# EAGLE design Circuit (EAGLE 9.6.2)
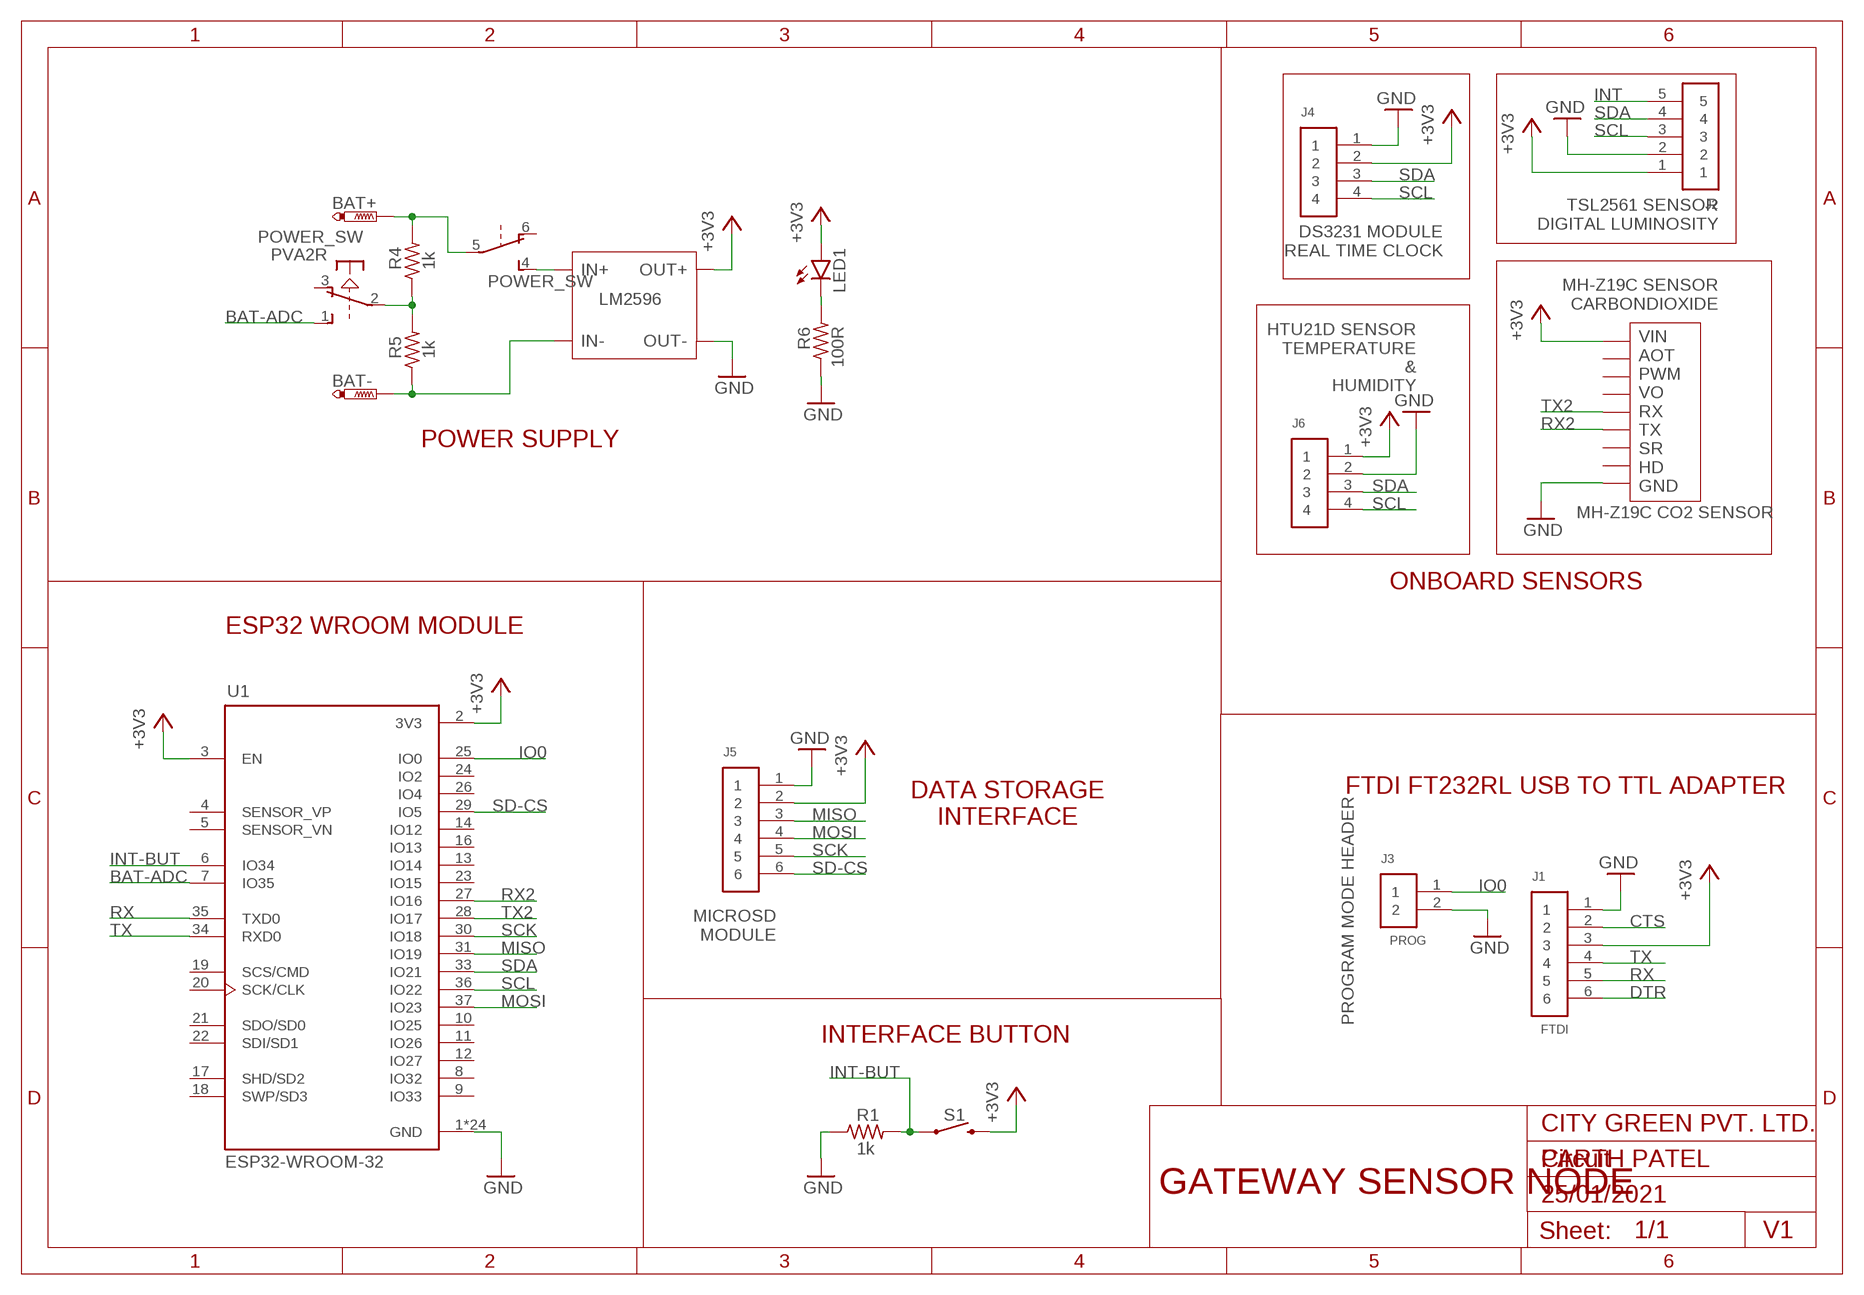
[diagram p0: schematic, sheet 1]

## Parts
BAT+  PTR1TP20SQ  [TP20SQ]
BAT-  PTR1TP20SQ  [TP20SQ]
J1  FTDI  61300611121  [61300611121]
J2  TSL2561  61300511121  [61300511121]
J3  PROG  61300211121  [61300211121]
J4  DS3231  61300411121  [61300411121]
J5  MicroSD  61300611121  [61300611121]
J6  HTU21D  61300411121  [61300411121]
LED1  LED3MM  [LED3MM]
POWER_SW  PVA2R  [PVA2R]
R1  1k  R-US_0204/7  [0204/7]
R4  1k  R-US_0204/7  [0204/7]
R5  1k  R-US_0204/7  [0204/7]
R6  100R  R-US_0204/7  [0204/7]
S1  MOMENTARY-SWITCH-SPST-PTH-6.0MM  [TACTILE_SWITCH_PTH_6.0MM]
U1  ESP32-WROOM-32  [MODULE_ESP32-WROOM-32]
U$1  MH-Z19C  [MH-Z19C]
U$2  XL6009  [XL6009]

## Nets
+3V3: J1.3 J2.1 J4.2 J5.2 J6.1 LED1.A S1.3 U1.2(3V3) U1.3(EN) U$1.PWM(VIN) U$2.OUT+
BAT-ADC: POWER_SW.1(1:S) U1.7(IO35)
BAT-ADC-IN: POWER_SW.2(1:P) R4.1 R5.2
CTS: J1.2
DTR: J1.6
GND: J1.1 J2.2 J3.2 J4.1 J5.1 J6.2 R1.1 R6.1 U1.1(GND) U1.15(GND) U1.38(GND) U1.39_1(GND) U1.39_2(GND) U1.39_3(GND) U1.39_4(GND) U1.39_5(GND) U1.39_6(GND) U1.39_7(GND) U1.39_8(GND) U1.39_9(GND) U1.39_10(GND) U1.39_11(GND) U1.39_12(GND) U1.39_13(GND) U1.39_14(GND) U1.39_15(GND) U1.39_16(GND) U1.39_17(GND) U1.39_18(GND) U1.39_19(GND) U1.39_20(GND) U1.39_21(GND) U$1.AOT(GND) U$2.OUT-
INT: J2.5
INT-BUT: R1.2 S1.1 U1.6(IO34)
IO0: J3.1 U1.25(IO0)
MISO: J5.3 U1.31(IO19)
MOSI: J5.4 U1.37(IO23)
N$1: BAT+.TP POWER_SW.5(2:P) R4.2
N$2: LED1.K(C) R6.2
N$3: BAT-.TP R5.1 U$2.IN-
N$4: POWER_SW.4(2:S) U$2.IN+
RX: J1.5 U1.35(TXD0)
RX2: U1.27(IO16) U$1.TX
SCK: J5.5 U1.30(IO18)
SCL: J2.3 J4.4 J6.4 U1.36(IO22)
SD-CS: J5.6 U1.29(IO5)
SDA: J2.4 J4.3 J6.3 U1.33(IO21)
TX: J1.4 U1.34(RXD0)
TX2: U1.28(IO17) U$1.SR(RX)
Unconnected: POWER_SW.3(1:O) POWER_SW.6(2:O) U1.4(SENSOR_VP) U1.5(SENSOR_VN) U1.8(IO32) U1.9(IO33) U1.10(IO25) U1.11(IO26) U1.12(IO27) U1.13(IO14) U1.14(IO12) U1.16(IO13) U1.17(SHD/SD2) U1.18(SWP/SD3) U1.19(SCS/CMD) U1.20(SCK/CLK) U1.21(SDO/SD0) U1.22(SDI/SD1) U1.23(IO15) U1.24(IO2) U1.26(IO4) U$1.GND(AOT) U$1.HD(VO) U$1.RX(SR) U$1.VIN(PWM) U$1.VO(HD)

## Notes on the sheet
- TSL2561 SENSOR
  DIGITAL LUMINOSITY
- DS3231 MODULE
  REAL TIME CLOCK
- MH-Z19C SENSOR
  CARBONDIOXIDE
- HTU21D SENSOR
  TEMPERATURE
  &
  HUMIDITY
- POWER SUPPLY
- ONBOARD SENSORS
- ESP32 WROOM MODULE
- FTDI FT232RL USB TO TTL ADAPTER
- DATA STORAGE
  INTERFACE
- MICROSD
  MODULE
- PROGRAM MODE HEADER
- INTERFACE BUTTON
- CITY GREEN PVT. LTD.
- PARTH PATEL
- GATEWAY SENSOR NODE
- 25/01/2021
- V1

## Library data of the parts
BAT+ BAT- = testpad:PTR1: TEST PIN
J1 J5 = Headers:61300611121: CONN HEADER VERT 6POS 2.54MM Manufacturer's datasheet <https://katalog.we-online.de/em/datasheet/6130xx11121.pdf>; CREATED_BY: PCBLayout.com; DIGI_KEY_PART_NUMBER: 732-5319-ND; MANUFACTURER: Wurth Electronics Inc.; MPN: 61300611121
J2 = Headers:61300511121: CONN HEADER VERT 5POS 2.54MM Manufacturer's datasheet <https://katalog.we-online.de/em/datasheet/6130xx11121.pdf>; CREATED_BY: PCBLayout.com; DIGI_KEY_PART_NUMBER: 732-5318-ND; MANUFACTURER: Wurth Electronics Inc.; MPN: 61300511121
J3 = Headers:61300211121: CONN HEADER VERT 2POS 2.54MM Manufacturer's datasheet <https://katalog.we-online.de/em/datasheet/6130xx11121.pdf>; CREATED_BY: PCBLayout.com; DIGI_KEY_PART_NUMBER: 732-5315-ND; MANUFACTURER: Wurth Electronics Inc.; MPN: 61300211121
J4 J6 = Headers:61300411121: CONN HEADER VERT 4POS 2.54MM Manufacturer's datasheet <https://katalog.we-online.de/em/datasheet/6130xx11121.pdf>; CREATED_BY: PCBLayout.com; DIGI_KEY_PART_NUMBER: 732-5317-ND; MANUFACTURER: Wurth Electronics Inc.; MPN: 61300411121
LED1 = led:LED: LED OSRAM: - CHIPLED LG R971, LG N971, LY N971, LG Q971, LY Q971, LO R971, LY R971 LH N974, LH R974 LS Q976, LO Q976, LY Q976 LO Q996 - Hyper CHIPLED LW Q18S LB Q993, LB Q99A, LB R99A - SideLED LS A670, LO A670, LY A670, LG A670, LP A670 LB A673, LV A673, LT A673, LW A673 LH A674 LY A675 LS A676, LA A676, LO A676, LY A676, LW A676 LS A679, LY A679, LG A679 - Hyper Micro SIDELED® LS Y876, LA Y876, LO Y876, LY Y876 LT Y87S - SmartLED LW L88C, LW L88S LB L89C, LB L89S, LG L890 LS L89K, LO L89K, LY L89K LS L896, LA L896, LO L896, LY L896 - TOPLED LS T670, LO T670, LY T670, LG T670, LP T670 LSG T670, LSP T670, LSY T670, LOP T670, LYG T670 LG T671, LOG T671, LSG T671 LB T673, LV T673, LT T673, LW T673 LH T674 LS T676, LA T676, LO T676, LY T676, LB T676, LH T676, LSB T676, LW T676 LB T67C, LV T67C, LT T67C, LS T67K, LO T67K, LY T67K, LW E67C LS E67B, LA E67B, LO E67B, LY E67B, LB E67C, LV E67C, LT E67C LW T67C LS T679, LY T679, LG T679 LS T770, LO T770, LY T770, LG T770, LP T770 LB T773, LV T773, LT T773, LW T773 LH T774 LS E675, LA E675, LY E675, LS T675 LS T776, LA T776, LO T776, LY T776, LB T776 LHGB T686 LT T68C, LB T68C - Hyper Mini TOPLED® LB M676 - Mini TOPLED Santana® LG M470 LS M47K, LO M47K, LY M47K Source: http://www.osram.convergy.de LUXEON: - LUMILED® LXK2-PW12-R00, LXK2-PW12-S00, LXK2-PW14-U00, LXK2-PW14-V00 LXK2-PM12-R00, LXK2-PM12-S00, LXK2-PM14-U00 LXK2-PE12-Q00, LXK2-PE12-R00, LXK2-PE12-S00, LXK2-PE14-T00, LXK2-PE14-U00 LXK2-PB12-K00, LXK2-PB12-L00, LXK2-PB12-M00, LXK2-PB14-N00, LXK2-PB14-P00, LXK2-PB14-Q00 LXK2-PR12-L00, LXK2-PR12-M00, LXK2-PR14-Q00, LXK2-PR14-R00 LXK2-PD12-Q00, LXK2-PD12-R00, LXK2-PD12-S00 LXK2-PH12-R00, LXK2-PH12-S00 LXK2-PL12-P00, LXK2-PL12-Q00, LXK2-PL12-R00 Source: www.luxeon.com KINGBRIGHT: KA-3528ASYC Source: www.kingbright.com
POWER_SW = switch-misc:PVA2R: ITT SWITCH
R1 R4-R6 = rcl:R-US_: RESISTOR, American symbol; SPICEPREFIX: R
S1 = SparkFun-Switches:MOMENTARY-SWITCH-SPST: Momentary Switch (Pushbutton) - SPST Normally-open (NO) SPST momentary switches (buttons, pushbuttons). Variants PTH-12MM - 12mm square, through-hole Momentary Pushbutton Switch - 12mm Square <https://www.sparkfun.com/products/9190> (COM-09190) PTH-6.0MM, PTH-6.0MM-KIT - 6.0mm square, through-hole Mini Pushbutton Switch <https://www.sparkfun.com/products/97> (COM-00097) KIT package intended for soldering kit's - only one side of pads' copper is exposed. PTH-RIGHT-ANGLE-KIT - Right-angle, through-hole Right Angle Tactile Button <https://www.sparkfun.com/products/10791> - Used on SparkFun BigTime Watch Kit <https://www.sparkfun.com/products/11734> SMD-12MM - 12mm square, surface-mount Tactile Button - SMD (12mm) <https://www.sparkfun.com/products/12993> (COM-12993) Used on SparkFun PicoBoard <https://www.sparkfun.com/products/11888> SMD-4.5MM - 4.5mm Square Trackball Switch Used on SparkFun Blackberry Trackballer Breakout <https://www.sparkfun.com/products/13169> SMD-4.6MMX2.8MM - 4.60mm x 2.80mm, surface mount Used on SparkFun SAMD21 Mini Breakout <https://www.sparkfun.com/products/13664> SMD-5.2MM, SMD-5.2-REDUNDANT - 5.2mm square, surface-mount Mini Pushbutton Switch - SMD <https://www.sparkfun.com/products/8720> (COM-08720) Used on Arduino Pro Mini <https://www.sparkfun.com/products/11114> REDUNDANT package connects both switch circuits together SMD-6.0X3.5MM - 6.0 x 3.5mm, surface mount Momentary Reset Switch SMD <https://www.sparkfun.com/products/8229> (COM-08229) SMD-6.2MM-TALL - 6.2mm square, surface mount Tactile Button - SMD (6mm) <https://www.sparkfun.com/products/12992> Used on SparkFun Digital Sandbox <https://www.sparkfun.com/products/12651> SMD-RIGHT-ANGLE - Right-angle, surface mount Used on SparkFun Block for Intel® Edison - Arduino <https://www.sparkfun.com/products/13036>; PROD_ID: SWCH-08441; SF_SKU: COM-00097
U1 = ESP32 WROOM 32:ESP32-WROOM-32: Bluetooth, WiFi Transceiver Module 2.4GHz ~ 2.5GHz Surface Mount Check availability <https://pricing.snapeda.com/parts/ESP32-WROOM-32/Espressif%20Systems/view-part?ref=eda>; AVAILABILITY: In Stock; DESCRIPTION: Bluetooth, WiFi 802.11b/g/n, Bluetooth v4.2 +EDR, Class 1, 2 and 3 Transceiver Module 2.4GHz ~ 2.5GHz Antenna Not Included, U.FL Surface Mount; MF: Espressif Systems; MP: ESP32-WROOM-32; PACKAGE: Module Espressif Systems; PRICE: None; PURCHASE-URL: https://pricing.snapeda.com/search/part/ESP32-WROOM-32/?ref=eda
U$1 = MH-Z19 Sensor:MH-Z19C
U$2 = XL6009:XL6009

## Board
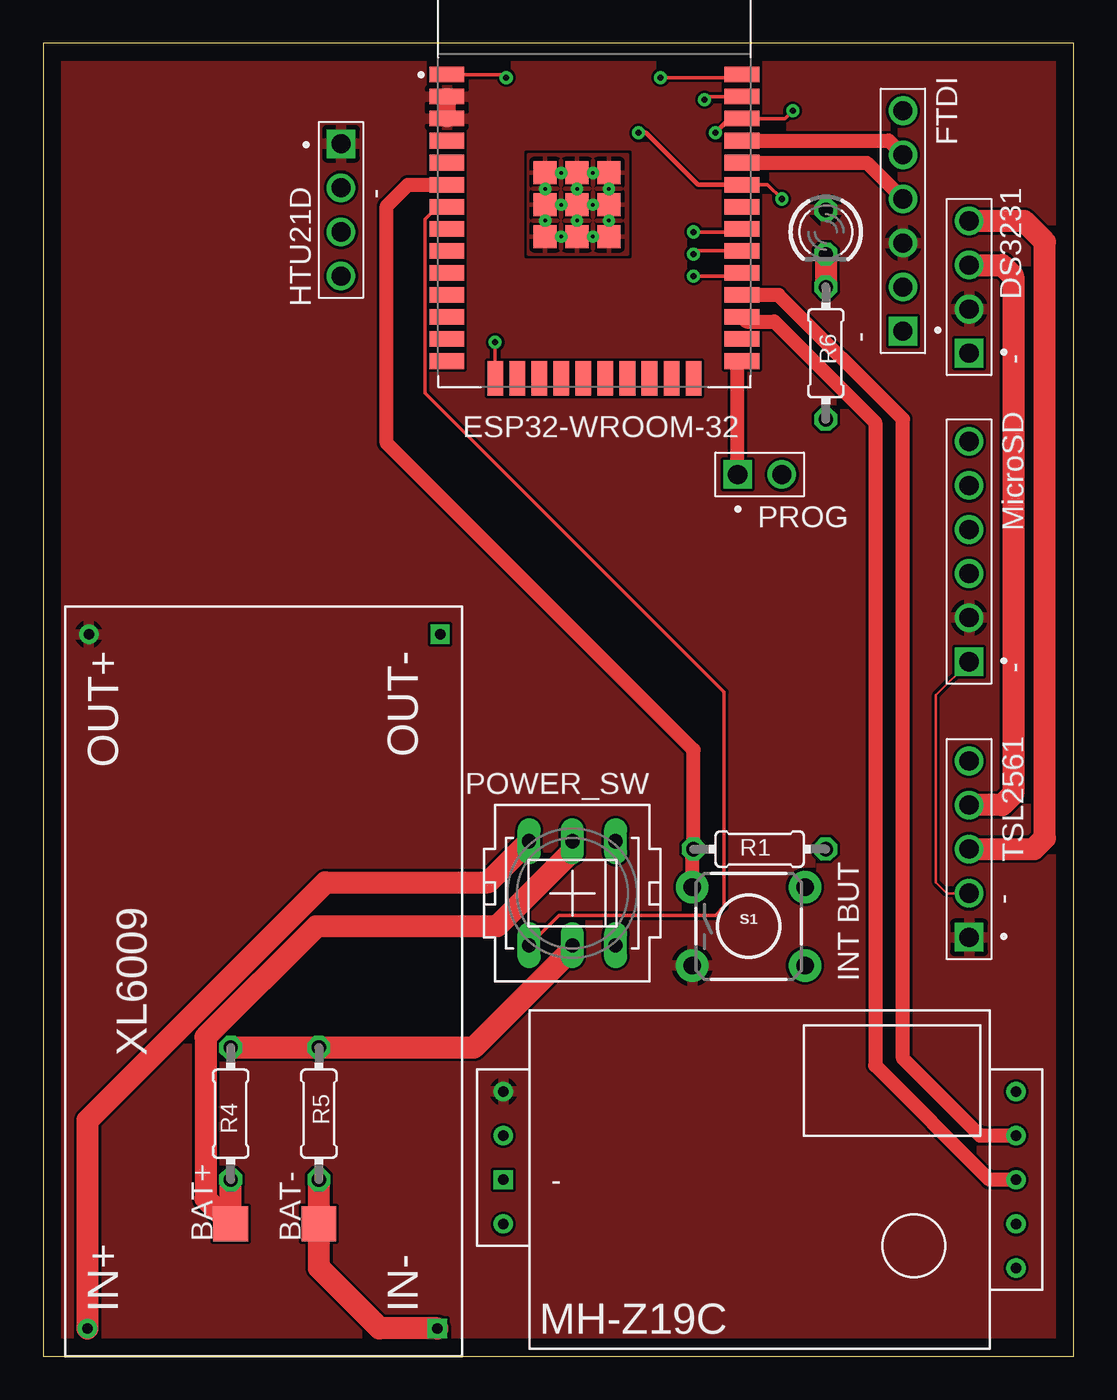
[diagram p1: board, top side]
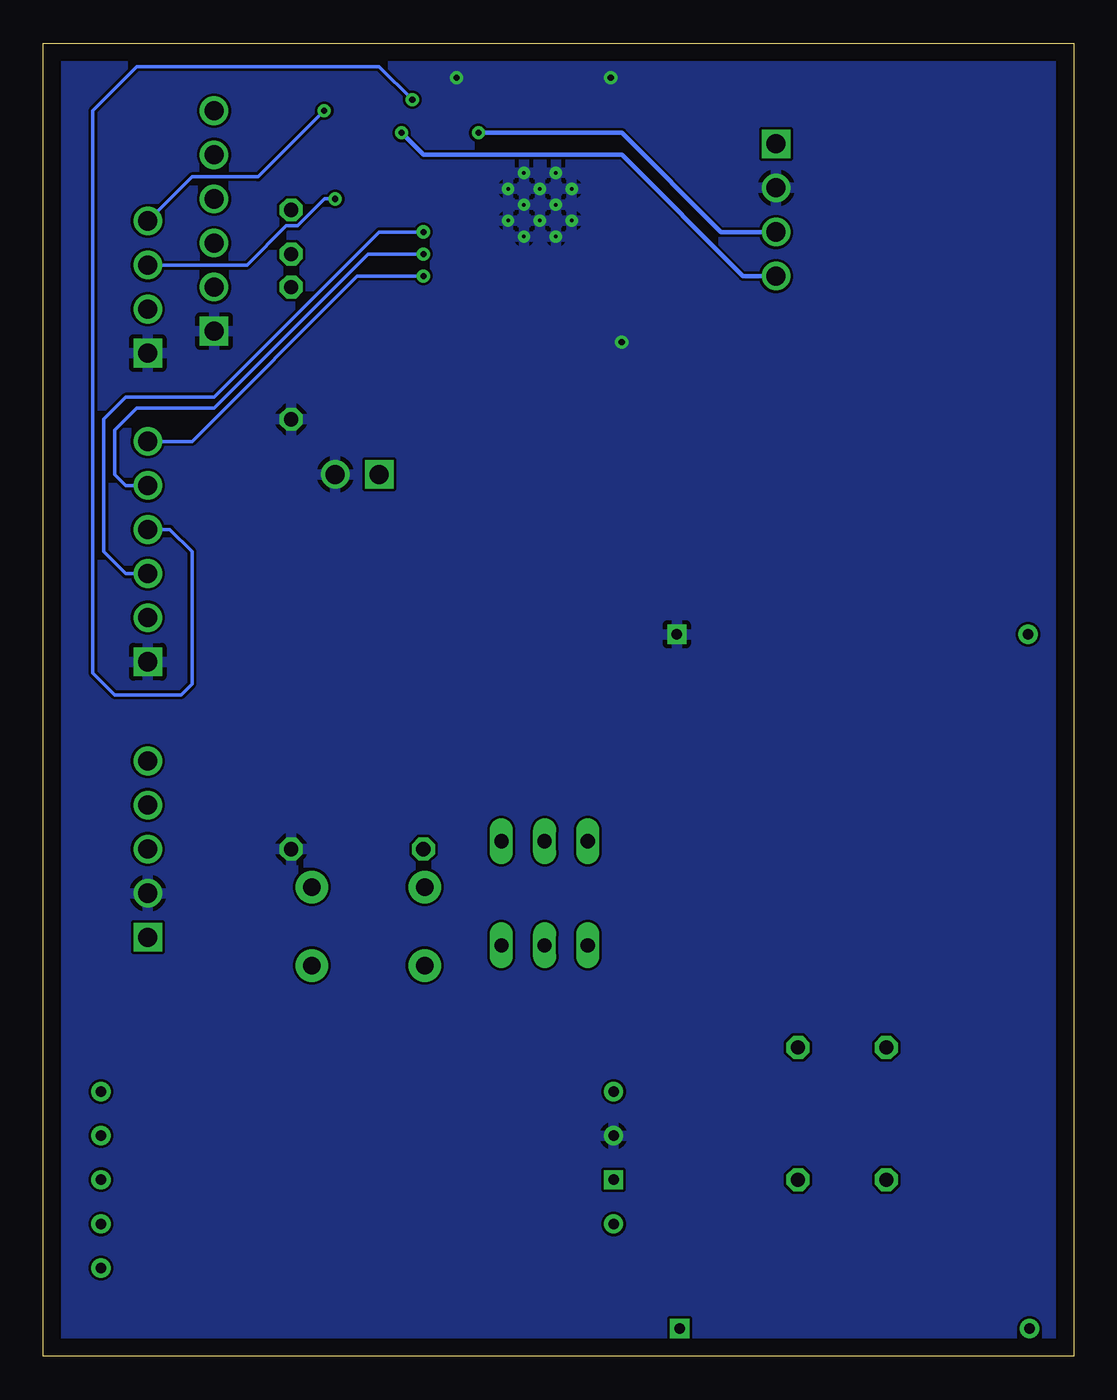
[diagram p2: board, bottom side, seen from below]

Size 59.36 x 75.64 mm. Coordinates in mm from the lower left corner, seen from the top.
Outline: 0,0 59.36,0 59.36,75.64 0,75.64 0,0
Copper layers (1*16): Top 0.035mm / dielectric 1.5mm / Bottom 0.035mm
Design rules "default": minimum track width 6mil, minimum drill 0.35mm, track to track 6mil, track to pad 6mil, pad to pad 6mil, via to via 6mil, smd to smd 6mil, copper to edge 40mil, drill to drill 6mil, minimum pad ring 10mil, minimum via ring 8mil, stop-mask expansion 4mil, vias tented up to drill 0mil, thermal gap 10mil

### Footprints (pad centres in the part's own frame; a part is rotated, then mirrored left to right if it is on the bottom)
TP20SQ = smd 2 x 2: TP 0,0
61300611121 = drill 1.1 square: 1 -6.35,0 | drill 1.1: 2 -3.81,0; 3 -1.27,0; 4 1.27,0; 5 3.81,0; 6 6.35,0
61300511121 = drill 1.1 square: 1 -5.08,0 | drill 1.1: 2 -2.54,0; 3 0,0; 4 2.54,0; 5 5.08,0
61300211121 = drill 1.1 square: 1 -1.27,0 | drill 1.1: 2 1.27,0
61300411121 = drill 1.1 square: 1 -3.81,0 | drill 1.1: 2 -1.27,0; 3 1.27,0; 4 3.81,0
LED3MM = drill 0.813 octagon: A -1.27,0; K 1.27,0
PVA2R = drill 0.813 long: 1 -2.997,2.489; 2 -2.997,0; 3 -2.997,-2.489; 4 2.997,2.489; 5 2.997,0; 6 2.997,-2.489
0204/7 = drill 0.813 octagon: 1 -3.81,0; 2 3.81,0
TACTILE_SWITCH_PTH_6.0MM = drill 1.016 pad 1.88: 1 -3.251,2.261; 2 3.251,2.261; 3 -3.251,-2.261; 4 3.251,-2.261
MODULE_ESP32-WROOM-32 = smd 2 x 0.9: 1 -8.5,5.26; 2 -8.5,3.99; 3 -8.5,2.72; 4 -8.5,1.45; 5 -8.5,0.18; 6 -8.5,-1.09; 7 -8.5,-2.36; 8 -8.5,-3.63; 9 -8.5,-4.9; 10 -8.5,-6.17; 11 -8.5,-7.44; 12 -8.5,-8.71; 13 -8.5,-9.98; 14 -8.5,-11.25; 25 8.5,-11.25; 26 8.5,-9.98; 27 8.5,-8.71; 28 8.5,-7.44; 29 8.5,-6.17; 30 8.5,-4.9; 31 8.5,-3.63; 32 8.5,-2.36; 33 8.5,-1.09; 34 8.5,0.18; 35 8.5,1.45; 36 8.5,2.72; 37 8.5,3.99; 38 8.5,5.26 | smd 0.9 x 2: 15 -5.715,-12.25; 16 -4.445,-12.25; 17 -3.175,-12.25; 18 -1.905,-12.25; 19 -0.635,-12.25; 20 0.635,-12.25; 21 1.905,-12.25; 22 3.175,-12.25; 23 4.445,-12.25; 24 5.715,-12.25 | smd 1.33 x 1.33: 39_1 -2.835,-0.405; 39_2 -1,-0.405; 39_3 0.835,-0.405; 39_4 -2.835,-2.24; 39_5 -1,-2.24; 39_6 0.835,-2.24; 39_7 -2.835,-4.075; 39_8 -1,-4.075; 39_9 0.835,-4.075 | drill 0.2 pad 0.3: 39_10 -1.917,-0.405; 39_11 -0.083,-0.405; 39_12 -2.835,-1.323; 39_13 -1,-1.323; 39_14 0.835,-1.323; 39_15 -1.917,-2.24; 39_16 -0.083,-2.24; 39_17 -2.835,-3.158; 39_18 -1,-3.158; 39_19 0.835,-3.158; 39_20 -1.917,-4.075; 39_21 -0.083,-4.075
MH-Z19C = drill 0.6: AOT -14.77,2.54; HD 14.77,5.08; PWM -14.77,5.08; RX 14.77,-2.54; SR 14.77,2.54; TX 14.77,0; VIN -14.77,-2.54; VO 14.77,-5.08 | drill 0.6 square: GND -14.77,0
XL6009 = drill 0.6: IN+ -20,10.16; OUT+ 20,10.08 | drill 0.6 square: IN- -20,-10; OUT- 20,-10.16

### Placement (x,y rotation side)
BAT+  10.79,7.62 90 top
BAT-  15.88,7.62 90 top
J1  49.53,65.41 90 top
J2  53.34,29.21 90 top
J3  41.27,50.8 0 top
J4  53.34,61.59 90 top
J5  53.34,46.35 90 top
J6  17.14,66.04 270 top
LED1  45.09,64.77 270 top
POWER_SW  30.48,26.67 90 top
R1  41.27,29.21 180 top
R4  10.79,13.97 270 top
R5  15.88,13.97 90 top
R6  45.09,57.78 90 top
S1  40.64,24.77 0 top
U1  31.75,68.58 0 top
U$1  41.27,10.16 0 top
U$2  12.7,21.59 90 top

### Tracks (layer width: path | path; a pad name or v marks a point on that pad's centre or on a via)
+3V3
  Top 1.016: U1.2 U1.3
  pour Top (rank 2): -0.64,75.56 -0.64,-0.64 59.69,-0.64 59.69,75.56
BAT-ADC
  Top 0.2: POWER_SW.1 29.72,25.4 38.72,25.4 39.22,25.9 39.22,38.25 22,55.47 22,65.5 22.71,66.22 U1.7
BAT-ADC-IN
  Top 1.27: R4.1 R5.2 24.81,17.78 30.48,23.45 POWER_SW.2
GND  (via drill 0.35)
  Top 0.152: J2.2 52.07,26.67 51.44,27.3 51.44,38.1 J5.1
  Top 0.2: U1.1 26.49,73.84 v26.67,73.66 | U1.38 40.07,73.66 v35.56,73.66 | U1.15 v26.04,58.42
  pour Bottom: -1.27,76.2 60.33,76.2 60.33,-1.27 -1.27,-1.27
  pour Top: 27.94,69.22 27.94,63.5 33.66,63.5 33.66,69.22
INT-BUT
  Top 0.813: S1.1 37.39,29.13 R1.2 37.47,34.92 19.79,52.6 19.79,66.27 21.01,67.49 U1.6
IO0
  Top 0.813: J3.1 40.01,57.09 U1.25
MISO  (via drill 0.35)
  Top 0.2: U1.31 40.07,64.77 v37.47,64.77
  Bottom 0.2: v37.47,64.77 40.01,64.77 49.53,55.24 54.61,55.24 55.88,53.98 55.88,46.35 54.61,45.09 J5.3
MOSI  (via drill 0.35)
  Top 0.2: U1.37 38.28,72.57 v38.1,72.39
  Bottom 0.2: J5.4 52.07,47.62 50.8,46.35 50.8,38.73 51.44,38.1 55.24,38.1 56.52,39.37 56.52,71.75 53.98,74.3 40.01,74.3 v38.1,72.39
N$1
  Top 1.27: R4.2 BAT+.TP 9.35,9.07 9.35,18.38 15.73,24.77 26.14,24.77 30.48,29.1 POWER_SW.5
N$2
  Top 1.27: LED1.K R6.2
N$3
  Top 1.27: R5.1 BAT-.TP 15.88,5.08 19.36,1.59 U$2.IN-
N$4
  Top 1.27: U$2.IN+ 2.54,13.58 16.26,27.3 25.63,27.3 POWER_SW.4
RX
  Top 0.813: U1.35 48.72,70.03 J1.5
RX2
  Top 0.813: U1.27 40.51,59.61 42.12,59.61 47.93,53.8 47.93,16.75 54.52,10.16 U$1.TX
SCK  (via drill 0.35)
  Top 0.2: U1.30 37.65,63.68 v37.47,63.5
  Bottom 0.2: v37.47,63.5 40.64,63.5 49.53,54.61 53.98,54.61 55.24,53.34 55.24,50.8 54.61,50.16 J5.5
SCL  (via drill 0.35)
  Top 0.2: U1.36 42.73,71.3 v43.18,71.75
  Top 0.254: v38.72,70.48 39.53,71.3 U1.36
  Top 1.27: J2.3 57.07,29.21 57.71,29.84 57.71,64.21 56.52,65.41 J4.4
  Bottom 0.2: J4.4 50.8,67.94 46.99,67.94 v43.18,71.75
  Bottom 0.254: J6.4 19.05,62.23 26.04,69.22 37.47,69.22 37.47,69.23 v38.72,70.48
SD-CS  (via drill 0.35)
  Top 0.2: U1.29 40.07,62.23 v37.47,62.23
  Bottom 0.2: v37.47,62.23 41.27,62.23 50.8,52.7 J5.6
SDA  (via drill 0.35)
  Top 0.2: U1.33 41.73,67.49 v42.55,66.67
  Top 0.254: U1.33 37.71,67.49 34.72,70.48 v34.29,70.48
  Top 1.27: J4.3 55.24,62.87 55.88,62.23 55.88,32.38 55.24,31.75 J2.4
  Bottom 0.2: v42.55,66.67 43.16,66.67 44.71,65.13 45.36,65.13 47.62,62.87 J4.3
  Bottom 0.254: J6.3 20.32,64.77 26.04,70.48 v34.29,70.48
TX
  Top 0.813: U1.34 47.45,68.76 J1.4
TX2
  Top 0.813: U$1.SR 53.98,12.7 49.53,17.14 49.53,53.98 42.37,61.14 U1.28

### Text on the board
tNames: - | - | - | - | - | INT BUT | -